# EAGLE schematic Xpander6-VIC (EAGLE 7.7.0)
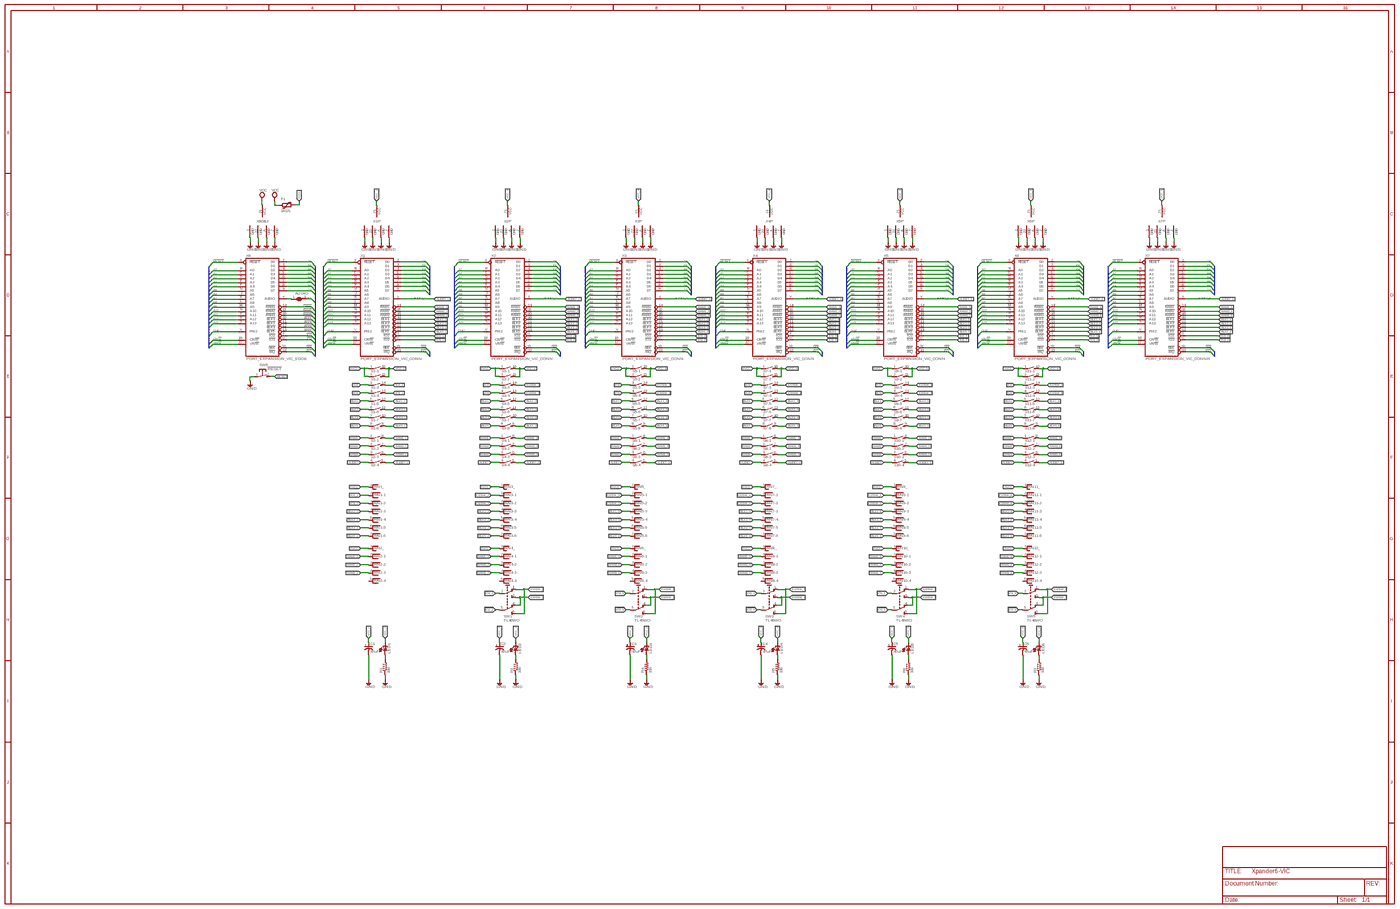
[diagram p0: schematic, sheet 1, overview]
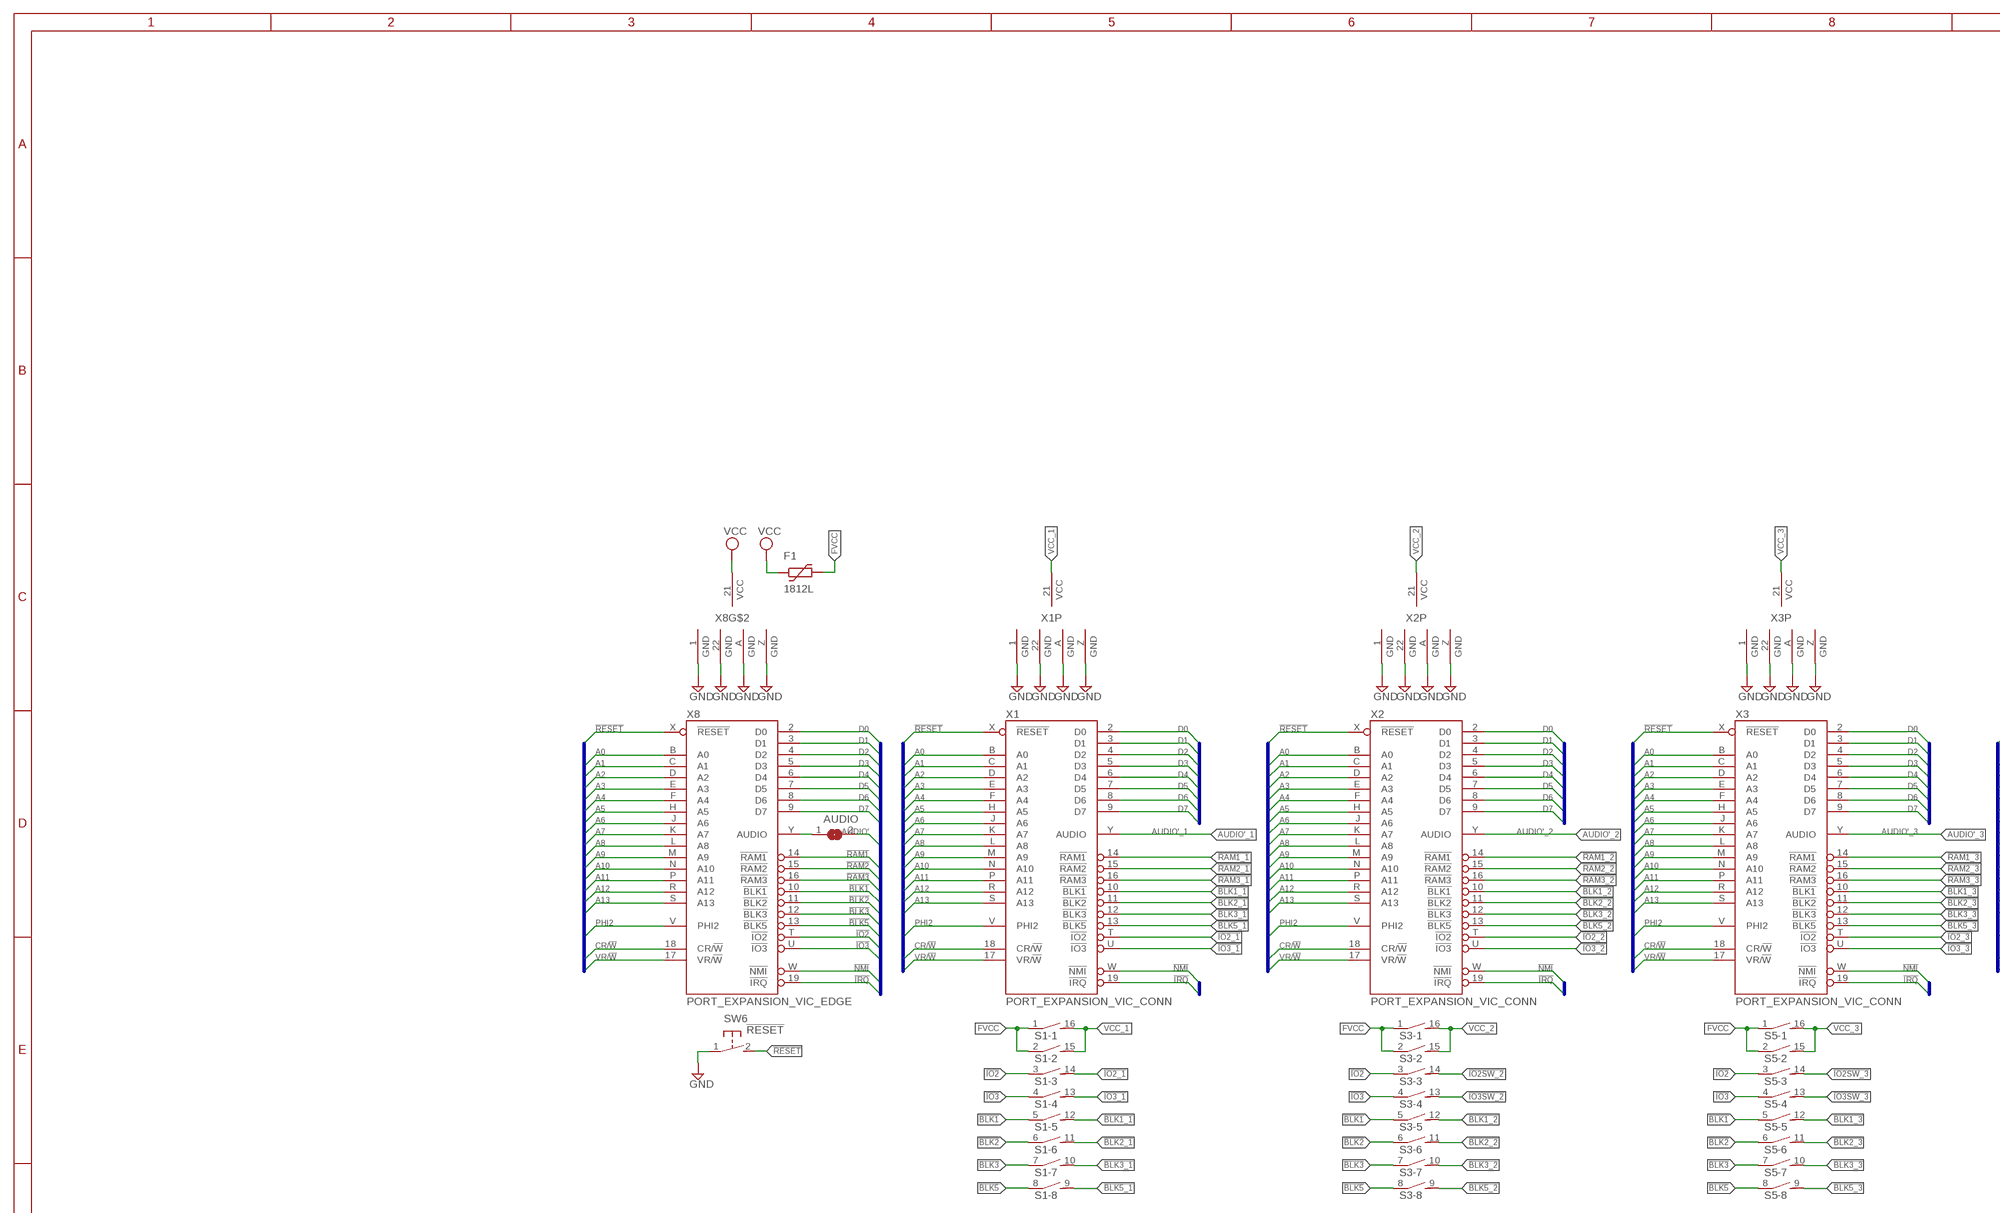
[diagram p1: schematic, sheet 1, part 1 of 4]
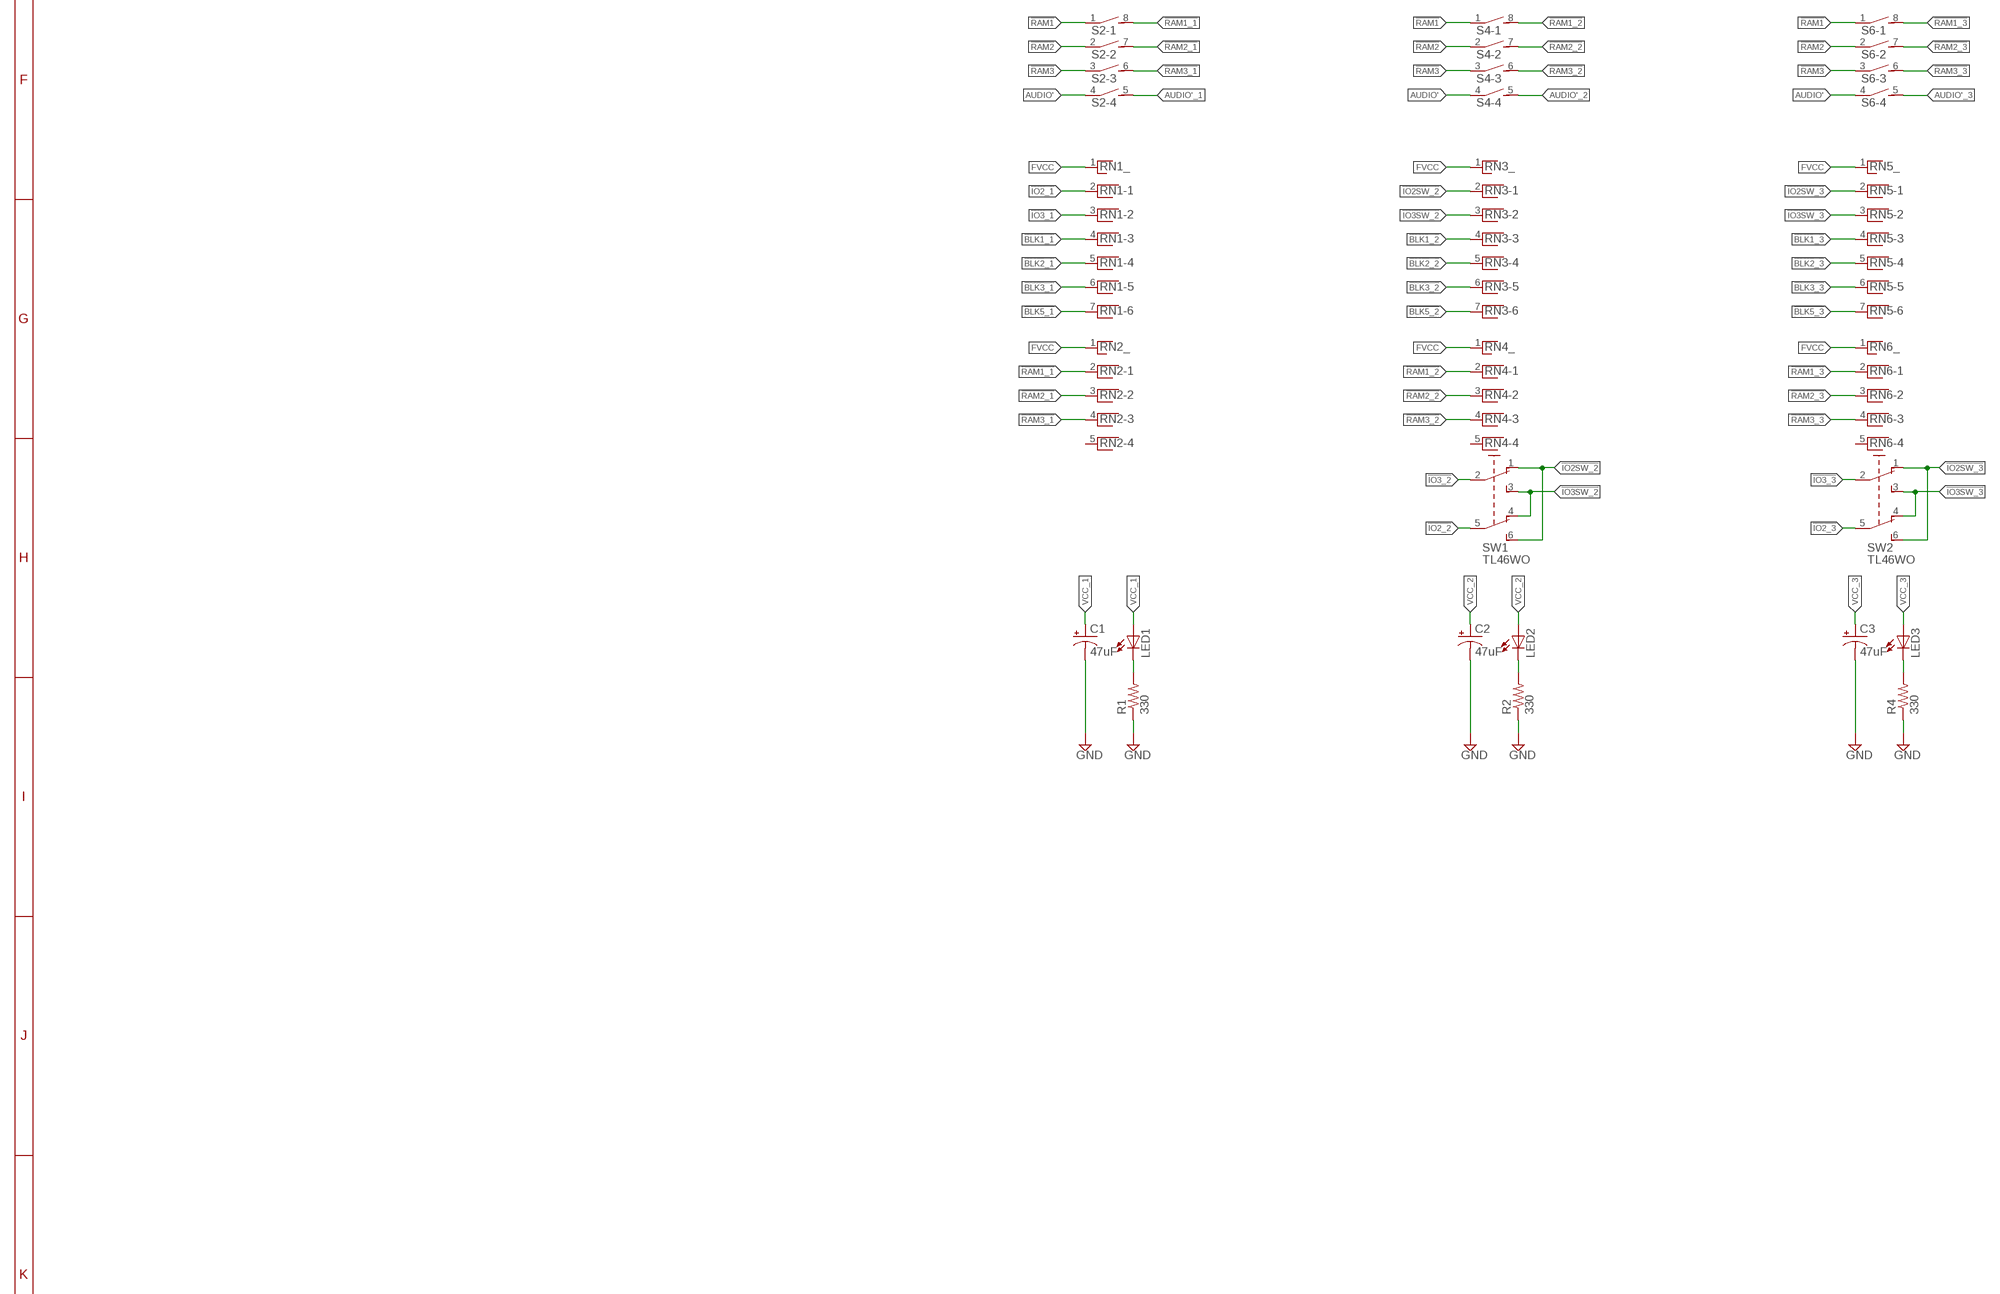
[diagram p2: schematic, sheet 1, part 2 of 4]
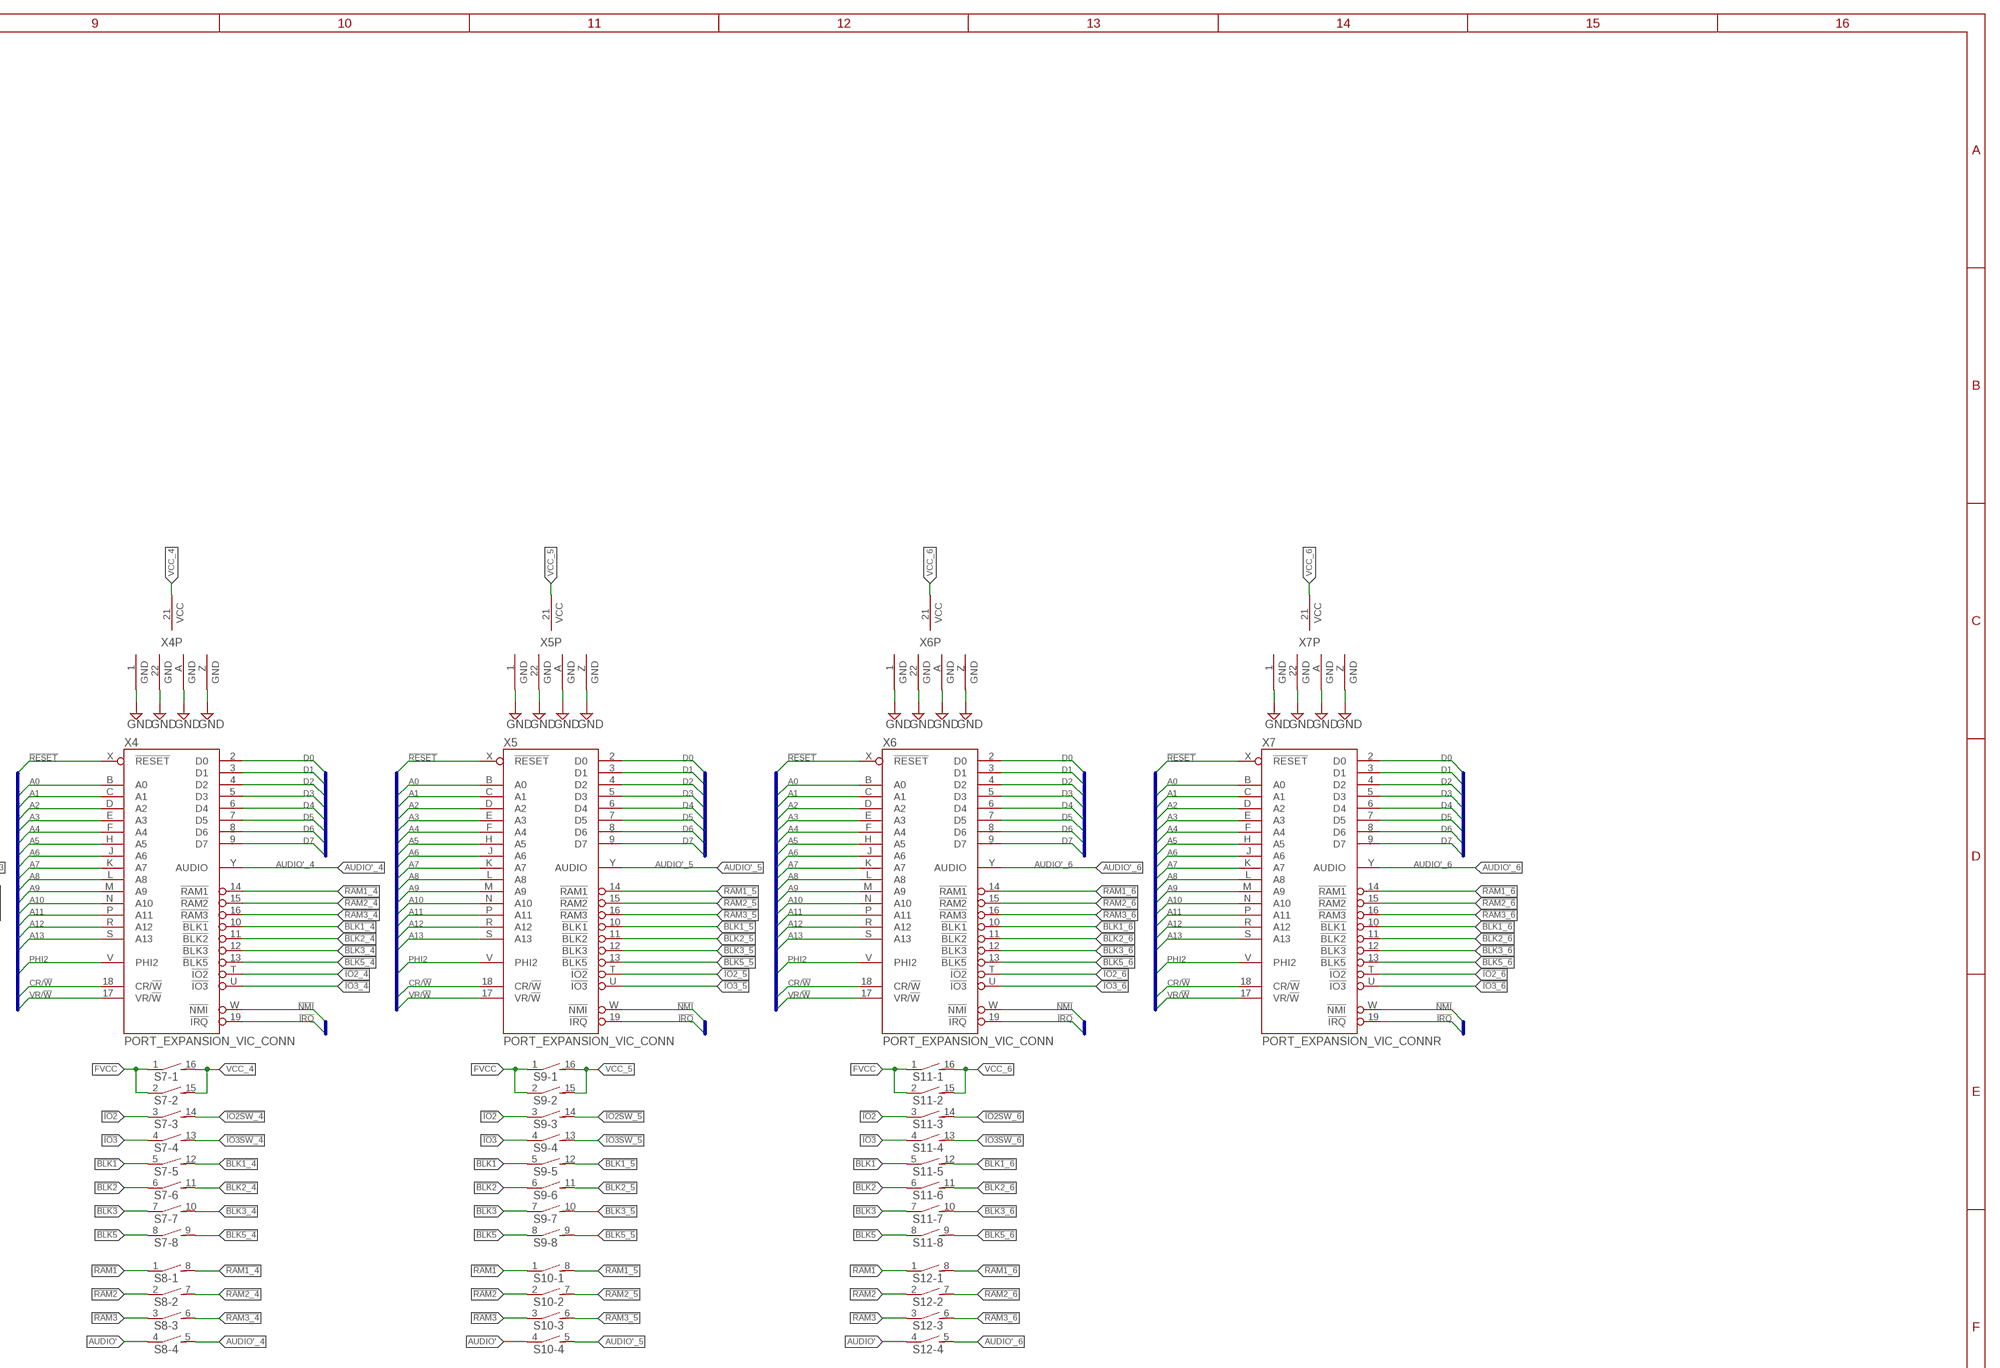
[diagram p3: schematic, sheet 1, part 3 of 4]
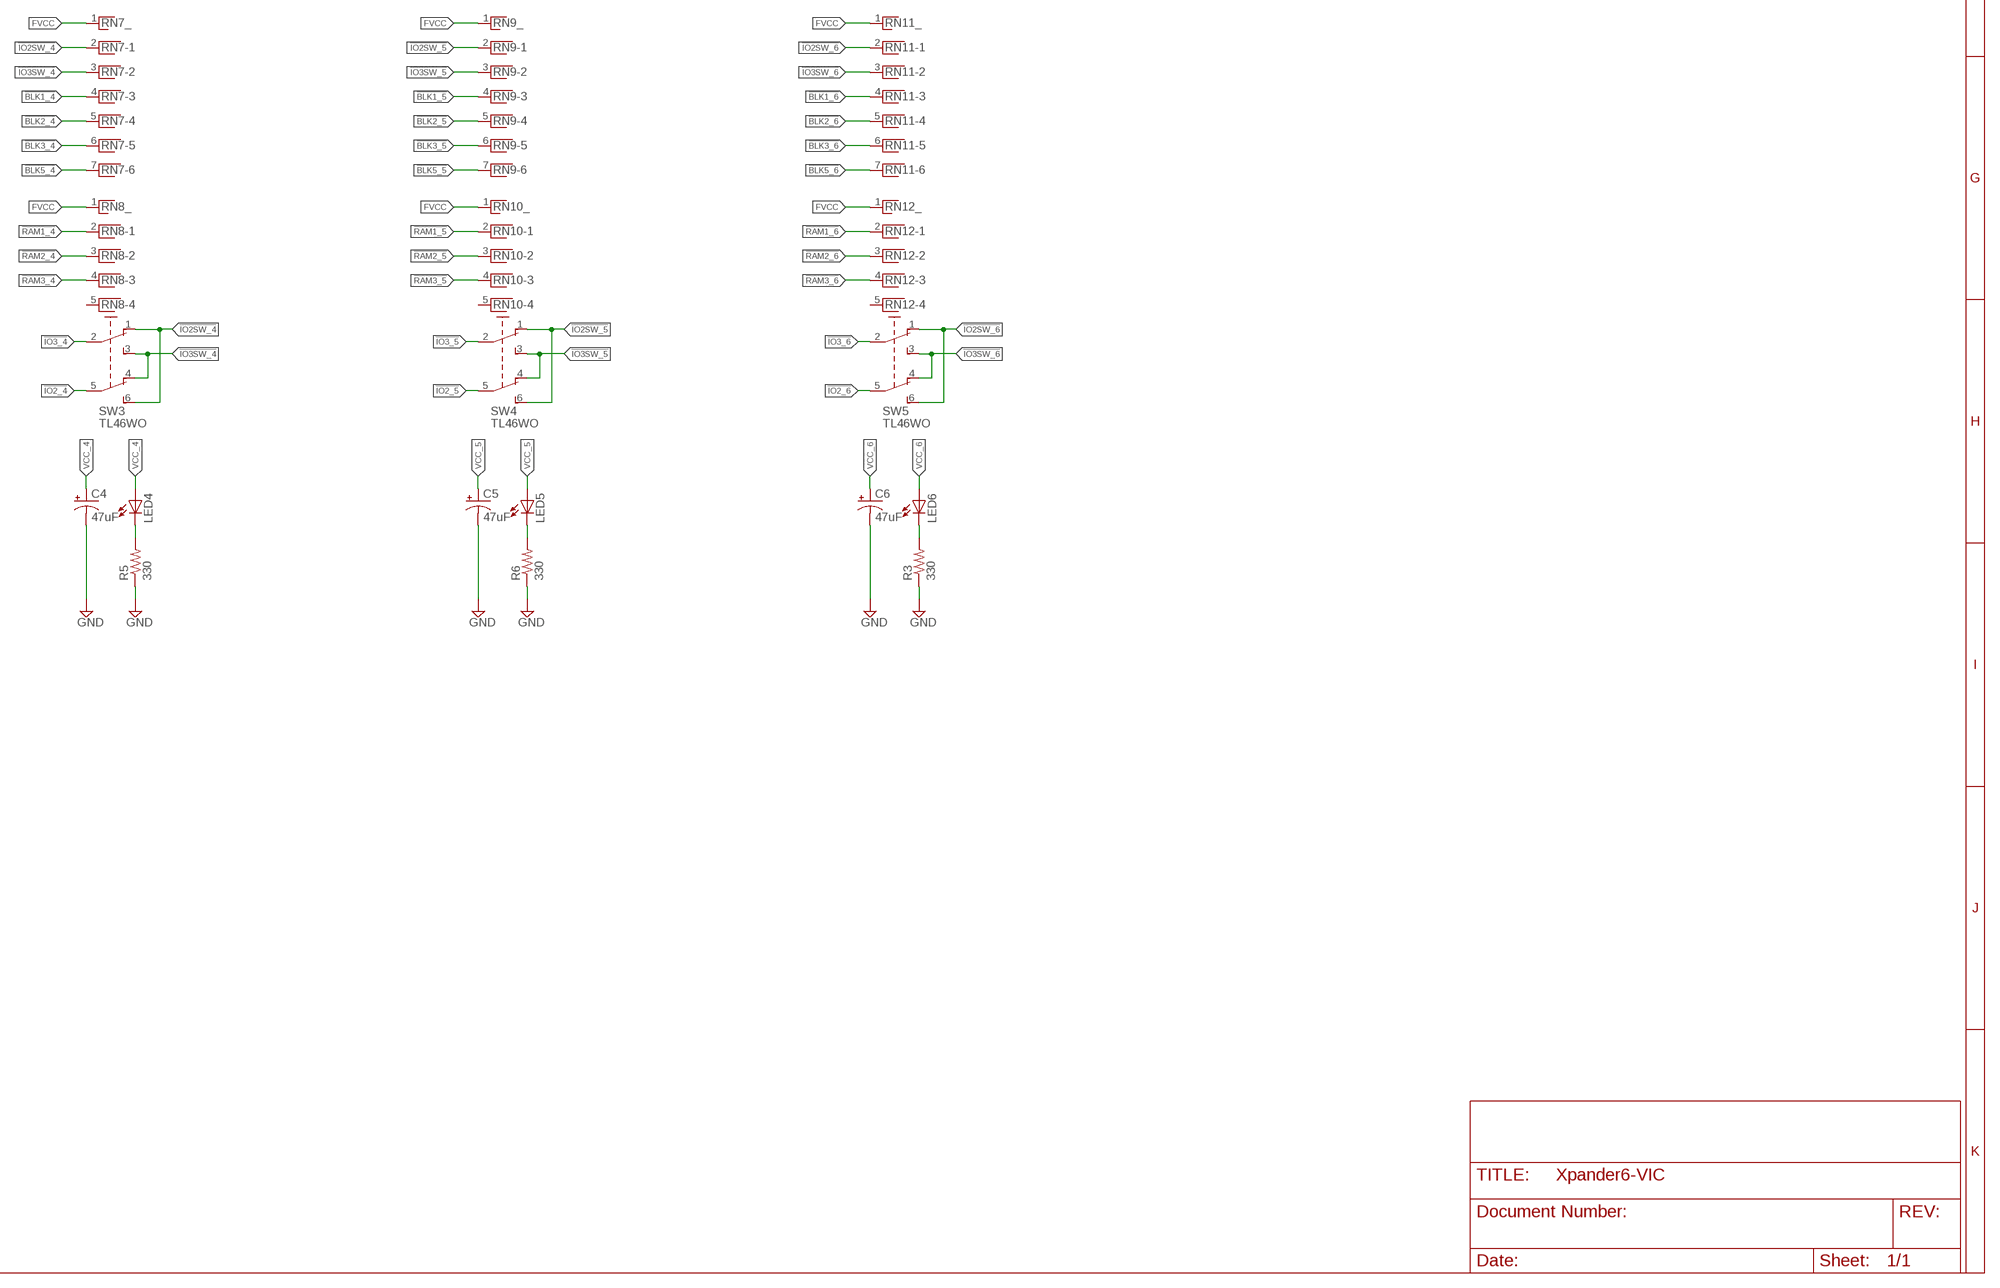
[diagram p4: schematic, sheet 1, part 4 of 4]

## Parts
AUDIO  SJ  [SJ]
C1  47uF  CPOL-USE2,5-6E  [E2,5-6E]
C2  47uF  CPOL-USE2,5-6E  [E2,5-6E]
C3  47uF  CPOL-USE2,5-6E  [E2,5-6E]
C4  47uF  CPOL-USE2,5-6E  [E2,5-6E]
C5  47uF  CPOL-USE2,5-6E  [E2,5-6E]
C6  47uF  CPOL-USE2,5-6E  [E2,5-6E]
F1  1812L  [1812L]
LED1  LED3MM  [LED3MM]
LED2  LED3MM  [LED3MM]
LED3  LED3MM  [LED3MM]
LED4  LED3MM  [LED3MM]
LED5  LED3MM  [LED3MM]
LED6  LED3MM  [LED3MM]
R1  330  R-US_0204/7  [0204/7]
R2  330  R-US_0204/7  [0204/7]
R3  330  R-US_0204/7  [0204/7]
R4  330  R-US_0204/7  [0204/7]
R5  330  R-US_0204/7  [0204/7]
R6  330  R-US_0204/7  [0204/7]
RN1  RNX6  [RN-7]
RN2  RNX4  [RN-5]
RN3  RNX6  [RN-7]
RN4  RNX4  [RN-5]
RN5  RNX6  [RN-7]
RN6  RNX4  [RN-5]
RN7  RNX6  [RN-7]
RN8  RNX4  [RN-5]
RN9  RNX6  [RN-7]
RN10  RNX4  [RN-5]
RN11  RNX6  [RN-7]
RN12  RNX4  [RN-5]
S1  DIP08SB  [DIP08SB]
S2  DIP04SB  [DIP04SB]
S3  DIP08SB  [DIP08SB]
S4  DIP04SB  [DIP04SB]
S5  DIP08SB  [DIP08SB]
S6  DIP04SB  [DIP04SB]
S7  DIP08SB  [DIP08SB]
S8  DIP04SB  [DIP04SB]
S9  DIP08SB  [DIP08SB]
S10  DIP04SB  [DIP04SB]
S11  DIP08SB  [DIP08SB]
S12  DIP04SB  [DIP04SB]
SW1  TL46WO  [TL4XWO]
SW2  TL46WO  [TL4XWO]
SW3  TL46WO  [TL4XWO]
SW4  TL46WO  [TL4XWO]
SW5  TL46WO  [TL4XWO]
SW6  !RESET  31-XX  [B3F-31XX]
X1  PORT_EXPANSION_VIC_CONN  [FE156-22-2]
X2  PORT_EXPANSION_VIC_CONN  [FE156-22-2]
X3  PORT_EXPANSION_VIC_CONN  [FE156-22-2]
X4  PORT_EXPANSION_VIC_CONN  [FE156-22-2]
X5  PORT_EXPANSION_VIC_CONN  [FE156-22-2]
X6  PORT_EXPANSION_VIC_CONN  [FE156-22-2]
X7  PORT_EXPANSION_VIC_CONNR  [MA156-22-2SHORT]
X8  PORT_EXPANSION_VIC_EDGE  [MA156-22-2]

## Nets
!BLK1: S1.5 S3.5 S5.5 S7.5 S9.5 S11.5 X8.10(!BLK1)
!BLK1_1: RN1.4 S1.12 X1.10(!BLK1)
!BLK1_2: RN3.4 S3.12 X2.10(!BLK1)
!BLK1_3: RN5.4 S5.12 X3.10(!BLK1)
!BLK1_4: RN7.4 S7.12 X4.10(!BLK1)
!BLK1_5: RN9.4 S9.12 X5.10(!BLK1)
!BLK1_6: RN11.4 S11.12 X6.10(!BLK1) X7.10(!BLK1)
!BLK2: S1.6 S3.6 S5.6 S7.6 S9.6 S11.6 X8.11(!BLK2)
!BLK2_1: RN1.5 S1.11 X1.11(!BLK2)
!BLK2_2: RN3.5 S3.11 X2.11(!BLK2)
!BLK2_3: RN5.5 S5.11 X3.11(!BLK2)
!BLK2_4: RN7.5 S7.11 X4.11(!BLK2)
!BLK2_5: RN9.5 S9.11 X5.11(!BLK2)
!BLK2_6: RN11.5 S11.11 X6.11(!BLK2) X7.11(!BLK2)
!BLK3: S1.7 S3.7 S5.7 S7.7 S9.7 S11.7 X8.12(!BLK3)
!BLK3_1: RN1.6 S1.10 X1.12(!BLK3)
!BLK3_2: RN3.6 S3.10 X2.12(!BLK3)
!BLK3_3: RN5.6 S5.10 X3.12(!BLK3)
!BLK3_4: RN7.6 S7.10 X4.12(!BLK3)
!BLK3_5: RN9.6 S9.10 X5.12(!BLK3)
!BLK3_6: RN11.6 S11.10 X6.12(!BLK3) X7.12(!BLK3)
!BLK5: S1.8 S3.8 S5.8 S7.8 S9.8 S11.8 X8.13(!BLK5)
!BLK5_1: RN1.7 S1.9 X1.13(!BLK5)
!BLK5_2: RN3.7 S3.9 X2.13(!BLK5)
!BLK5_3: RN5.7 S5.9 X3.13(!BLK5)
!BLK5_4: RN7.7 S7.9 X4.13(!BLK5)
!BLK5_5: RN9.7 S9.9 X5.13(!BLK5)
!BLK5_6: RN11.7 S11.9 X6.13(!BLK5) X7.13(!BLK5)
!IO2: S1.3 S3.3 S5.3 S7.3 S9.3 S11.3 X8.T(!IO2)
!IO2_1: RN1.2 S1.14 X1.T(!IO2)
!IO2_2: SW1.5(P1) X2.T(!IO2)
!IO2_3: SW2.5(P1) X3.T(!IO2)
!IO2_4: SW3.5(P1) X4.T(!IO2)
!IO2_5: SW4.5(P1) X5.T(!IO2)
!IO2_6: SW5.5(P1) X6.T(!IO2) X7.T(!IO2)
!IO2SW_2: RN3.2 S3.14 SW1.1(O) SW1.6(S1)
!IO2SW_3: RN5.2 S5.14 SW2.1(O) SW2.6(S1)
!IO2SW_4: RN7.2 S7.14 SW3.1(O) SW3.6(S1)
!IO2SW_5: RN9.2 S9.14 SW4.1(O) SW4.6(S1)
!IO2SW_6: RN11.2 S11.14 SW5.1(O) SW5.6(S1)
!IO3: S1.4 S3.4 S5.4 S7.4 S9.4 S11.4 X8.U(!IO3)
!IO3_1: RN1.3 S1.13 X1.U(!IO3)
!IO3_2: SW1.2(P) X2.U(!IO3)
!IO3_3: SW2.2(P) X3.U(!IO3)
!IO3_4: SW3.2(P) X4.U(!IO3)
!IO3_5: SW4.2(P) X5.U(!IO3)
!IO3_6: SW5.2(P) X6.U(!IO3) X7.U(!IO3)
!IO3SW_2: RN3.3 S3.13 SW1.3(S) SW1.4(O1)
!IO3SW_3: RN5.3 S5.13 SW2.3(S) SW2.4(O1)
!IO3SW_4: RN7.3 S7.13 SW3.3(S) SW3.4(O1)
!IO3SW_5: RN9.3 S9.13 SW4.3(S) SW4.4(O1)
!IO3SW_6: RN11.3 S11.13 SW5.3(S) SW5.4(O1)
!IRQ: X1.19(!IRQ) X2.19(!IRQ) X3.19(!IRQ) X4.19(!IRQ) X5.19(!IRQ) X6.19(!IRQ) X7.19(!IRQ) X8.19(!IRQ)
!NMI: X1.W(!NMI) X2.W(!NMI) X3.W(!NMI) X4.W(!NMI) X5.W(!NMI) X6.W(!NMI) X7.W(!NMI) X8.W(!NMI)
!RAM1: S2.1 S4.1 S6.1 S8.1 S10.1 S12.1 X8.14(!RAM1)
!RAM1_1: RN2.2 S2.8 X1.14(!RAM1)
!RAM1_2: RN4.2 S4.8 X2.14(!RAM1)
!RAM1_3: RN6.2 S6.8 X3.14(!RAM1)
!RAM1_4: RN8.2 S8.8 X4.14(!RAM1)
!RAM1_5: RN10.2 S10.8 X5.14(!RAM1)
!RAM1_6: RN12.2 S12.8 X6.14(!RAM1) X7.14(!RAM1)
!RAM2: S2.2 S4.2 S6.2 S8.2 S10.2 S12.2 X8.15(!RAM2)
!RAM2_1: RN2.3 S2.7 X1.15(!RAM2)
!RAM2_2: RN4.3 S4.7 X2.15(!RAM2)
!RAM2_3: RN6.3 S6.7 X3.15(!RAM2)
!RAM2_4: RN8.3 S8.7 X4.15(!RAM2)
!RAM2_5: RN10.3 S10.7 X5.15(!RAM2)
!RAM2_6: RN12.3 S12.7 X6.15(!RAM2) X7.15(!RAM2)
!RAM3: S2.3 S4.3 S6.3 S8.3 S10.3 S12.3 X8.16(!RAM3)
!RAM3_1: RN2.4 S2.6 X1.16(!RAM3)
!RAM3_2: RN4.4 S4.6 X2.16(!RAM3)
!RAM3_3: RN6.4 S6.6 X3.16(!RAM3)
!RAM3_4: RN8.4 S8.6 X4.16(!RAM3)
!RAM3_5: RN10.4 S10.6 X5.16(!RAM3)
!RAM3_6: RN12.4 S12.6 X6.16(!RAM3) X7.16(!RAM3)
!RESET: SW6.2(S) X1.X(!RESET) X2.X(!RESET) X3.X(!RESET) X4.X(!RESET) X5.X(!RESET) X6.X(!RESET) X7.X(!RESET) X8.X(!RESET)
A0: X1.B(A0) X2.B(A0) X3.B(A0) X4.B(A0) X5.B(A0) X6.B(A0) X7.B(A0) X8.B(A0)
A1: X1.C(A1) X2.C(A1) X3.C(A1) X4.C(A1) X5.C(A1) X6.C(A1) X7.C(A1) X8.C(A1)
A2: X1.D(A2) X2.D(A2) X3.D(A2) X4.D(A2) X5.D(A2) X6.D(A2) X7.D(A2) X8.D(A2)
A3: X1.E(A3) X2.E(A3) X3.E(A3) X4.E(A3) X5.E(A3) X6.E(A3) X7.E(A3) X8.E(A3)
A4: X1.F(A4) X2.F(A4) X3.F(A4) X4.F(A4) X5.F(A4) X6.F(A4) X7.F(A4) X8.F(A4)
A5: X1.H(A5) X2.H(A5) X3.H(A5) X4.H(A5) X5.H(A5) X6.H(A5) X7.H(A5) X8.H(A5)
A6: X1.J(A6) X2.J(A6) X3.J(A6) X4.J(A6) X5.J(A6) X6.J(A6) X7.J(A6) X8.J(A6)
A7: X1.K(A7) X2.K(A7) X3.K(A7) X4.K(A7) X5.K(A7) X6.K(A7) X7.K(A7) X8.K(A7)
A8: X1.L(A8) X2.L(A8) X3.L(A8) X4.L(A8) X5.L(A8) X6.L(A8) X7.L(A8) X8.L(A8)
A9: X1.M(A9) X2.M(A9) X3.M(A9) X4.M(A9) X5.M(A9) X6.M(A9) X7.M(A9) X8.M(A9)
A10: X1.N(A10) X2.N(A10) X3.N(A10) X4.N(A10) X5.N(A10) X6.N(A10) X7.N(A10) X8.N(A10)
A11: X1.P(A11) X2.P(A11) X3.P(A11) X4.P(A11) X5.P(A11) X6.P(A11) X7.P(A11) X8.P(A11)
A12: X1.R(A12) X2.R(A12) X3.R(A12) X4.R(A12) X5.R(A12) X6.R(A12) X7.R(A12) X8.R(A12)
A13: X1.S(A13) X2.S(A13) X3.S(A13) X4.S(A13) X5.S(A13) X6.S(A13) X7.S(A13) X8.S(A13)
AUDIO: AUDIO.1 X8.Y(AUDIO)
AUDIO': AUDIO.2 S2.4 S4.4 S6.4 S8.4 S10.4 S12.4
AUDIO'_1: S2.5 X1.Y(AUDIO)
AUDIO'_2: S4.5 X2.Y(AUDIO)
AUDIO'_3: S6.5 X3.Y(AUDIO)
AUDIO'_4: S8.5 X4.Y(AUDIO)
AUDIO'_5: S10.5 X5.Y(AUDIO)
AUDIO'_6: S12.5 X6.Y(AUDIO) X7.Y(AUDIO)
CR/!W: X1.18(CR/!W) X2.18(CR/!W) X3.18(CR/!W) X4.18(CR/!W) X5.18(CR/!W) X6.18(CR/!W) X7.18(CR/!W) X8.18(CR/!W)
D0: X1.2(D0) X2.2(D0) X3.2(D0) X4.2(D0) X5.2(D0) X6.2(D0) X7.2(D0) X8.2(D0)
D1: X1.3(D1) X2.3(D1) X3.3(D1) X4.3(D1) X5.3(D1) X6.3(D1) X7.3(D1) X8.3(D1)
D2: X1.4(D2) X2.4(D2) X3.4(D2) X4.4(D2) X5.4(D2) X6.4(D2) X7.4(D2) X8.4(D2)
D3: X1.5(D3) X2.5(D3) X3.5(D3) X4.5(D3) X5.5(D3) X6.5(D3) X7.5(D3) X8.5(D3)
D4: X1.6(D4) X2.6(D4) X3.6(D4) X4.6(D4) X5.6(D4) X6.6(D4) X7.6(D4) X8.6(D4)
D5: X1.7(D5) X2.7(D5) X3.7(D5) X4.7(D5) X5.7(D5) X6.7(D5) X7.7(D5) X8.7(D5)
D6: X1.8(D6) X2.8(D6) X3.8(D6) X4.8(D6) X5.8(D6) X6.8(D6) X7.8(D6) X8.8(D6)
D7: X1.9(D7) X2.9(D7) X3.9(D7) X4.9(D7) X5.9(D7) X6.9(D7) X7.9(D7) X8.9(D7)
FVCC: F1.P$2 RN1.1 RN2.1 RN3.1 RN4.1 RN5.1 RN6.1 RN7.1 RN8.1 RN9.1 RN10.1 RN11.1 RN12.1 S1.1 S1.2 S3.1 S3.2 S5.1 S5.2 S7.1 S7.2 S9.1 S9.2 S11.1 S11.2
GND: C1.- C2.- C3.- C4.- C5.- C6.- R1.1 R2.1 R3.1 R4.1 R5.1 R6.1 SW6.1(P) X1.1(GND) X1.22(GND) X1.A(GND) X1.Z(GND) X2.1(GND) X2.22(GND) X2.A(GND) X2.Z(GND) X3.1(GND) X3.22(GND) X3.A(GND) X3.Z(GND) X4.1(GND) X4.22(GND) X4.A(GND) X4.Z(GND) X5.1(GND) X5.22(GND) X5.A(GND) X5.Z(GND) X6.1(GND) X6.22(GND) X6.A(GND) X6.Z(GND) X7.1(GND) X7.22(GND) X7.A(GND) X7.Z(GND) X8.1(GND) X8.22(GND) X8.A(GND) X8.Z(GND)
N$17: LED1.K(C) R1.2
N$25: LED2.K(C) R2.2
N$26: LED6.K(C) R3.2
N$43: LED3.K(C) R4.2
N$56: LED4.K(C) R5.2
N$69: LED5.K(C) R6.2
PHI2: X1.V(PHI2) X2.V(PHI2) X3.V(PHI2) X4.V(PHI2) X5.V(PHI2) X6.V(PHI2) X7.V(PHI2) X8.V(PHI2)
VCC: F1.P$1 X8.21(VCC)
VCC_1: C1.+ LED1.A S1.15 S1.16 X1.21(VCC)
VCC_2: C2.+ LED2.A S3.15 S3.16 X2.21(VCC)
VCC_3: C3.+ LED3.A S5.15 S5.16 X3.21(VCC)
VCC_4: C4.+ LED4.A S7.15 S7.16 X4.21(VCC)
VCC_5: C5.+ LED5.A S9.15 S9.16 X5.21(VCC)
VCC_6: C6.+ LED6.A S11.15 S11.16 X6.21(VCC) X7.21(VCC)
VR/!W: X1.17(VR/!W) X2.17(VR/!W) X3.17(VR/!W) X4.17(VR/!W) X5.17(VR/!W) X6.17(VR/!W) X7.17(VR/!W) X8.17(VR/!W)
Unconnected: RN2.5 RN4.5 RN6.5 RN8.5 RN10.5 RN12.5

## Buses
GND,VCC,1,2,3,4,5,6,7,8,9,10,11,12,13,14,15,16,17,18,19,20,21,B,C,D,E,F,H,J,K,L,M,N,P,R,S,T,U,V,W,X,Y

## Library data of the parts
AUDIO = jumper:SJ: SMD solder JUMPER
C1-C6 = rcl:CPOL-US: POLARIZED CAPACITOR, American symbol
F1 = ptc-littlefuse:1812L
LED1-LED6 = led:LED: LED OSRAM: - CHIPLED LG R971, LG N971, LY N971, LG Q971, LY Q971, LO R971, LY R971 LH N974, LH R974 LS Q976, LO Q976, LY Q976 LO Q996 - Hyper CHIPLED LW Q18S LB Q993, LB Q99A, LB R99A - SideLED LS A670, LO A670, LY A670, LG A670, LP A670 LB A673, LV A673, LT A673, LW A673 LH A674 LY A675 LS A676, LA A676, LO A676, LY A676, LW A676 LS A679, LY A679, LG A679 - Hyper Micro SIDELED® LS Y876, LA Y876, LO Y876, LY Y876 LT Y87S - SmartLED LW L88C, LW L88S LB L89C, LB L89S, LG L890 LS L89K, LO L89K, LY L89K LS L896, LA L896, LO L896, LY L896 - TOPLED LS T670, LO T670, LY T670, LG T670, LP T670 LSG T670, LSP T670, LSY T670, LOP T670, LYG T670 LG T671, LOG T671, LSG T671 LB T673, LV T673, LT T673, LW T673 LH T674 LS T676, LA T676, LO T676, LY T676, LB T676, LH T676, LSB T676, LW T676 LB T67C, LV T67C, LT T67C, LS T67K, LO T67K, LY T67K, LW E67C LS E67B, LA E67B, LO E67B, LY E67B, LB E67C, LV E67C, LT E67C LW T67C LS T679, LY T679, LG T679 LS T770, LO T770, LY T770, LG T770, LP T770 LB T773, LV T773, LT T773, LW T773 LH T774 LS E675, LA E675, LY E675, LS T675 LS T776, LA T776, LO T776, LY T776, LB T776 LHGB T686 LT T68C, LB T68C - Hyper Mini TOPLED® LB M676 - Mini TOPLED Santana® LG M470 LS M47K, LO M47K, LY M47K Source: http://www.osram.convergy.de LUXEON: - LUMILED® LXK2-PW12-R00, LXK2-PW12-S00, LXK2-PW14-U00, LXK2-PW14-V00 LXK2-PM12-R00, LXK2-PM12-S00, LXK2-PM14-U00 LXK2-PE12-Q00, LXK2-PE12-R00, LXK2-PE12-S00, LXK2-PE14-T00, LXK2-PE14-U00 LXK2-PB12-K00, LXK2-PB12-L00, LXK2-PB12-M00, LXK2-PB14-N00, LXK2-PB14-P00, LXK2-PB14-Q00 LXK2-PR12-L00, LXK2-PR12-M00, LXK2-PR14-Q00, LXK2-PR14-R00 LXK2-PD12-Q00, LXK2-PD12-R00, LXK2-PD12-S00 LXK2-PH12-R00, LXK2-PH12-S00 LXK2-PL12-P00, LXK2-PL12-Q00, LXK2-PL12-R00 Source: www.luxeon.com KINGBRIGHT: KA-3528ASYC Source: www.kingbright.com
R1-R6 = rcl:R-US_: RESISTOR, American symbol
RN1 RN3 RN5 RN7 RN9 RN11 = resistor-net-rp:RNX6: RESISTOR NETWORK; OC_FARNELL: unknown; OC_NEWARK: unknown
RN2 RN4 RN6 RN8 RN10 RN12 = resistor-net-rp:RNX4: RESISTOR NETWORK; OC_FARNELL: unknown; OC_NEWARK: unknown
S1 S3 S5 S7 S9 S11 = switch-dil-rp:DIP08SB: DIL/CODE SWITCH; OC_FARNELL: unknown; OC_NEWARK: unknown
S2 S4 S6 S8 S10 S12 = switch-dil-rp:DIP04SB: DIL/CODE SWITCH; OC_FARNELL: unknown; OC_NEWARK: unknown
SW1-SW5 = switch:TL46WO: TINY SWITCH ON - ON Source: http://www2.produktinfo.conrad.com/datenblaetter/700000-724999/705152-da-01-de-Subminiaturschalter_TL_36WO.pdf
SW6 = switch-omron:31-XX: OMRON SWITCH; MPN: B3F-3100; OC_FARNELL: 959704; OC_NEWARK: 36M3582
X1-X7 = commodore:PORT_EXPANSION_VIC_CONN: Expansionport of the Commodore VIC-20
X8 = commodore:PORT_EXPANSION_VIC_EDGE: Expansionport of the Commodore VIC-20